# Altium schematic sheet LNA.SchDoc
size A4; SheetNumber: 3; SheetTotal: 3
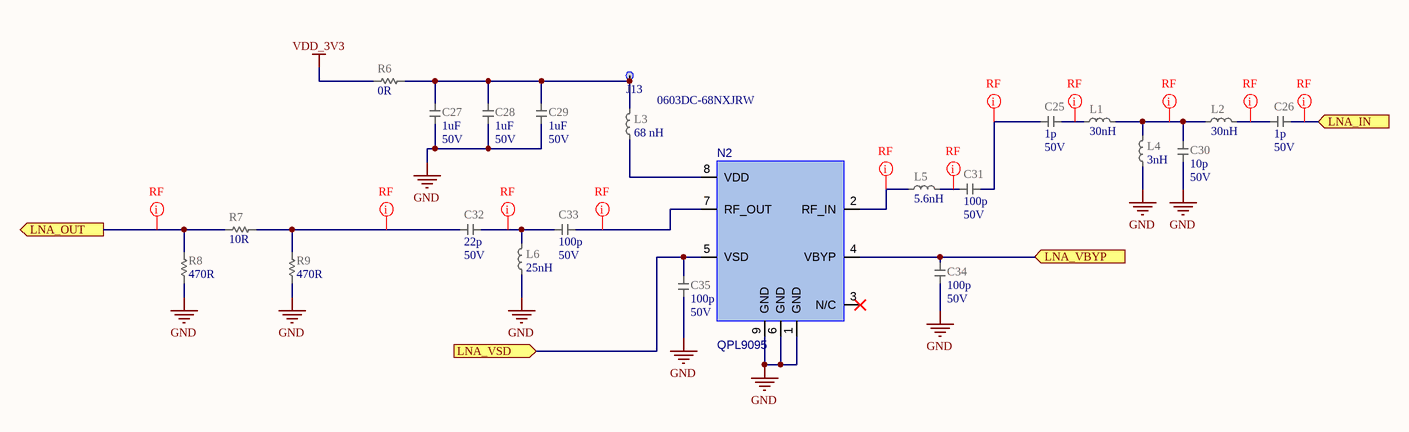
[diagram p0: LNA.SchDoc]

## Parts
C25  value 1p  Voltage: 50V  [CAP_0603_UN1Q]  (hidden comment: CAP_0603_1p)
C26  value 1p  Voltage: 50V  [CAP_0603_UN1Q]  (hidden comment: CAP_0603_1p)
C27  value 1uF  Voltage: 50V  [CAP_0603_UN1Q]  (hidden comment: CAP_0603_1u_X7R)
C28  value 1uF  Voltage: 50V  [CAP_0603_UN1Q]  (hidden comment: CAP_0603_1u_X7R)
C29  value 1uF  Voltage: 50V  [CAP_0603_UN1Q]  (hidden comment: CAP_0603_1u_X7R)
C30  value 10p  Voltage: 50V  [CAP_0603_UN1Q]  (hidden comment: CAP_0603_10p)
C31  value 100p  Voltage: 50V  [CAP_0603_UN1Q]  (hidden comment: CAP_0603_100p)
C32  value 22p  Voltage: 50V  [CAP_0603_UN1Q]  (hidden comment: CAP_0603_22p)
C33  value 100p  Voltage: 50V  [CAP_0603_UN1Q]  (hidden comment: CAP_0603_100p)
C34  value 100p  Voltage: 50V  [CAP_0603_UN1Q]  (hidden comment: CAP_0603_100p)
C35  value 100p  Voltage: 50V  [CAP_0603_UN1Q]  (hidden comment: CAP_0603_100p)
J13  Testpoint, Surface, 1.0mm  [TP_1mm_UN1Q]  (value not drawn)  (no BOM)
L1  value 30nH  [IND_0603_UN1Q]  (hidden comment: IND_0603_30n)
L2  value 30nH  [IND_0603_UN1Q]  (hidden comment: IND_0603_30n)
L3  value 68 nH  Part Number: 0603DC-68NXJRW  [IND_0603_Coilcraft_0603DC]  (hidden comment: IND_0603_68nH_Coilcraft_DC)
L4  value 3nH  [IND_0603_UN1Q]  (hidden comment: IND_0603_3n)
L5  value 5.6nH  [IND_0603_UN1Q]  (hidden comment: IND_0603_5_6n)
L6  value 25nH  [IND_0603_UN1Q]  (hidden comment: IND_0603_25n)
N2  QPL9095  [DFN8_P50_200x200x95_QORVO]
R6  value 0R  [RES_0805_UN1Q]  (hidden comment: RES_0805_0R0)
R7  value 10R  [RES_0603_UN1Q]  (hidden comment: RES_0603_10R)
R8  value 470R  [RES_0603_UN1Q]  (hidden comment: RES_0603_470R)
R9  value 470R  [RES_0603_UN1Q]  (hidden comment: RES_0603_470R)

## Ports
LNA_IN (in), LNA_OUT (out), LNA_VBYP (in), LNA_VSD (in)

## Nets
GND: C27.1 C28.1 C29.1 C30.1 C34.1 C35.1 L4.1 L6.1 N2.1(GND) N2.6(GND) N2.9(GND) R8.1 R9.1
VDD_3V3: R6.1
LNA_IN: C26.1 ; port LNA_IN
LNA_OUT: R7.1 R8.2 ; port LNA_OUT
LNA_VBYP: C34.2 N2.4(VBYP) ; port LNA_VBYP
LNA_VSD: C35.2 N2.5(VSD) ; port LNA_VSD
NetC25_1: C25.1 L1.1
NetC25_2: C25.2 C31.1
NetC26_2: C26.2 L2.2
NetC27_2: C27.2 C28.2 C29.2 J13.1(TP) L3.2 R6.2
NetC30_2: C30.2 L1.2 L2.1 L4.2
NetC31_2: C31.2 L5.2
NetC32_1: C32.1 C33.2 L6.2
NetC32_2: C32.2 R7.2 R9.2
NetC33_1: C33.1 N2.7(RF_OUT)
NetL3_1: L3.1 N2.8(VDD)
NetL5_1: L5.1 N2.2(RF_IN)

Not connected (* = marked no-connect by the designer): N2 3(N/C)*

## Layout directives
net class RF: LNA_IN, LNA_OUT, NetC25_1, NetC25_2, NetC26_2, NetC30_2, NetC31_2, NetC32_1, NetC32_2, NetC33_1, NetL5_1

## Library data of the parts
C25 C26 C30-C35 = CMP-001-000378-11: CAP; Manufacturer: Murata; Part Number: GCM188R71H102KA37J; Temperature characteristics: X7R; HasBeenBuilt: TBD; System: RLC; Alternative component: Allowed; Sort order: 306; Tolerance: +/-10%; Creation date: 20210927; Package: 0603; ComponentLink4Description: 4_X-information; ComponentLink2Description: 2_Product page; ECCN: EAR99; RoHS: RoHS3; Operating temperature range: -55 ... +125°C; ComponentLink3Description: 3_X-information; Source: RLC_UN1Q.SchLib; ComponentLink1Description: 1_Datasheet; Manufacturer Part Number: GCM188R71H102KA37J; Component Type: Capacitor
C27-C29 = CMP-001-000333-14: CAP; Part Number: UMK107AB7105KA-T; Manufacturer: Taiyo Yuden; Tolerance: +/-20%; Sort order: 306; HasBeenBuilt: TBD; Alternative component: Allowed; Temperature characteristics: X7R; System: RLC; Package: 0603; ComponentLink1Description: 1_Datasheet; ComponentLink2Description: 2_Product page; ComponentLink3Description: 3_X-information; ComponentLink4Description: 4_X-information; Creation date: 20210917; Source: RLC_UN1Q.SchLib; Manufacturer Part Number: UMK107AB7105KA-T; Component Type: Capacitor
J13 = CMP-001-000153-12: Testpoint 1.0mm; Part Number: TP 1mm; Sort order: -; HasBeenBuilt: -; ClassName: SMALL; ComponentLink1Description: 1_Datasheet; ComponentLink2Description: 2_Product page; ComponentLink3Description: 3_X-information; ComponentLink4Description: 4_X-information; Creation date: 20200101; System: Test Point; Design Item ID: TP_1mm; Source: Conn_UN1Q.SchLib; Component Type: Test Point
L1 L2 L4-L6 = CMP-034-000025-11: Manufacturer: TDK; Manufacturer Part Number: MLZ1608M100WTD25; Desc2: inductor_10uH_1R_250mA; Sort order: 346; Tolerance: 10%; HasBeenBuilt: False; Package: 0603; Dimensions WxLxH: 1.6 x 0.8 x 0.8 +-0.15; HasBeenChecked: False; ComponentLink1Description: 1_Datasheet; ComponentLink1URL: https://product.tdk.com/en/search/inductor/inductor/smd/info?part_no=MLZ1608M100WTD25; ComponentLink2Description: 2_Product page; ComponentLink3Description: 3_X-information; ComponentLink4Description: 4_X-information; Creation date: 20230111; Component Type: Inductor
L3 = CMP-001-001491-1: IND High Q Ceramic Chip; System: RLC; Tolerance: 10%; Sort order: 346; Dimensions WxLxH: 1.7 x 0.99 x 0.89; ComponentLink3Description: 3_X-information; Creation date: 20250807; ComponentLink1Description: 1_Datasheet; Package: 0603; ComponentLink1URL: https://www.coilcraft.com/en-us/products/rf/ceramic-core-chip-inductors/0603-(1608)/0603dc/?skuId=30647; Manufacturer: Coilcraft; ComponentLink2Description: 2_Product page; Operating temperature range: -55℃ to 125℃; ComponentLink4Description: 4_X-information; ECCN: EAR99; RoHS: RoHS 3; Manufacturer Part Number: 0603DC-68NXJRW; Component Type: Inductor
N2 = CMP-001-001198-7: Ultra Low-Noise, Bypass LNA; Manufacturer: Qorvo; Manufacturer Part Number: QPL9095SR; Sort order: 721; System: RF; ComponentLink4Description: 4_X-information; ComponentLink2URL: https://www.qorvo.com/products/p/QPL9095; ClassName: BIG; ComponentLink1Description: 1_Datasheet; Operating temperature range: -40°C ... 105°C; Package: DFN50; ComponentLink1URL: https://www.qorvo.com/products/d/da006183; Creation Date: 20240607; ComponentLink3Description: 3_X-information; ComponentLink3URL: https://www.qorvo.com/products/d/da006076; ComponentLink2Description: 2_Product page; Dimensions WxLxH: 2 x 2 x 0.95; Part Number: QPL9095; Component Type: RF IC
R6 = CMP-001-000676-11: RES 0805 0R.; Manufacturer: Susumu; Manufacturer Part Number: KRL1220E-M-R010-F; Tolerance: 1%; Sort order: 328; HasBeenBuilt: False; Power Rating: 1/2W; System: RLC; Package: 0805; Operating temperature range: -55C ... +155C; ComponentLink1Description: 1_Datasheet; ComponentLink1URL: https://www.susumu.co.jp/common/pdf/n_catalog_partition09_en.pdf; ComponentLink2Description: 2_Product page; ComponentLink3Description: 3_X-information; ComponentLink4Description: 4_X-information; Creation date: 20210928; Source: RLC_UN1Q.SchLib; Component Type: Resistor
R7-R9 = CMP-001-000441-13: RES; Manufacturer: YAGEO; Alternative component: Allowed; HasBeenBuilt: TBD; Tolerance: 5%; Sort order: 326; Power Rating: 1/10W; System: RLC; ComponentLink2Description: 2_Product page; Source: RLC_UN1Q.SchLib; ComponentLink3Description: 3_X-information; ComponentLink1Description: 1_Datasheet; Package: 0603; Creation date: 20190101; ComponentLink4Description: 4_X-information; Component Type: Resistor